# Altium schematic sheet ethernet_hdmi.SchDoc: Ethernet & HDMI
size A4; Organization: GPA Robotics; DocumentNumber: 9; Revision: REV 0; SheetNumber: 9; SheetTotal: 11
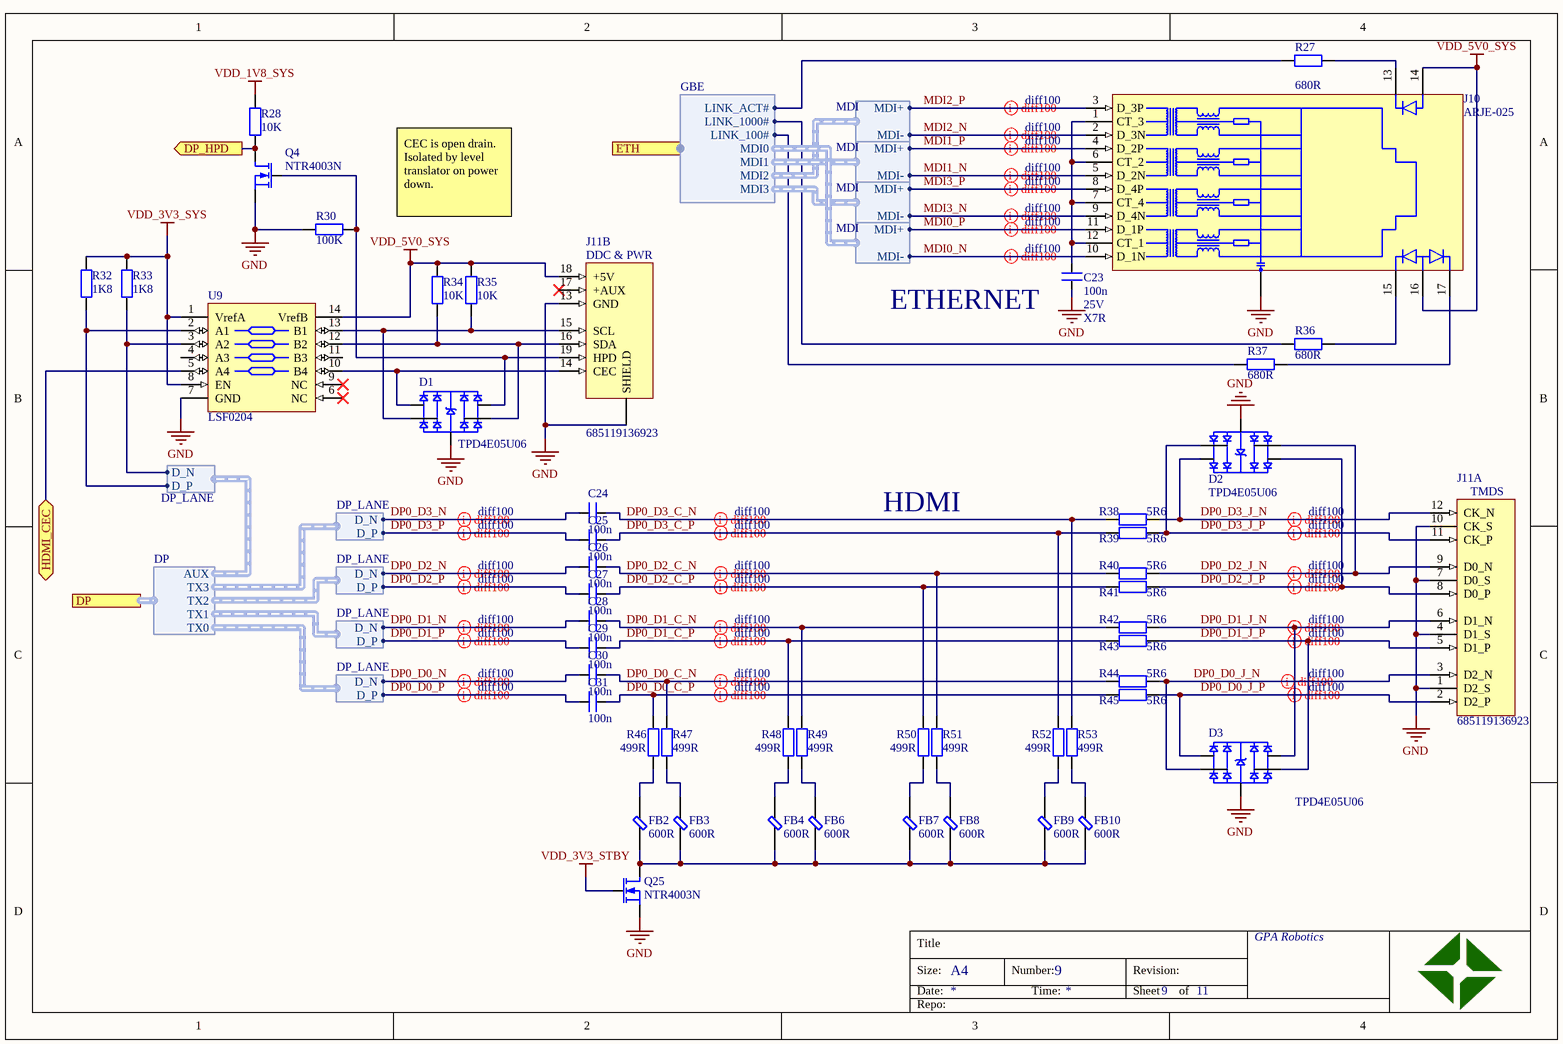
[diagram p0: ethernet_hdmi.SchDoc]

## Parts
C23  value 100n  Voltage: 25V  Type: X7R  [C1005[0402]]  (hidden comment: cap)
C24  value 100n  [C1005[0402]]  (hidden comment: cap)
C25  value 100n  [C1005[0402]]  (hidden comment: cap)
C26  value 100n  [C1005[0402]]  (hidden comment: cap)
C27  value 100n  [C1005[0402]]  (hidden comment: cap)
C28  value 100n  [C1005[0402]]  (hidden comment: cap)
C29  value 100n  [C1005[0402]]  (hidden comment: cap)
C30  value 100n  [C1005[0402]]  (hidden comment: cap)
C31  value 100n  [C1005[0402]]  (hidden comment: cap)
D1  TPD4E05U06  [TI_PSON50P100X55-10N]
D2  TPD4E05U06  [TI_PSON50P100X55-10N]
D3  TPD4E05U06  [TI_PSON50P100X55-10N]
FB2  value 600R  [FBC1005X06N]  (hidden comment: Ferrite bead)
FB3  value 600R  [FBC1005X06N]  (hidden comment: Ferrite bead)
FB4  value 600R  [FBC1005X06N]  (hidden comment: Ferrite bead)
FB6  value 600R  [FBC1005X06N]  (hidden comment: Ferrite bead)
FB7  value 600R  [FBC1005X06N]  (hidden comment: Ferrite bead)
FB8  value 600R  [FBC1005X06N]  (hidden comment: Ferrite bead)
FB9  value 600R  [FBC1005X06N]  (hidden comment: Ferrite bead)
FB10  value 600R  [FBC1005X06N]  (hidden comment: Ferrite bead)
J10  ARJE-025  [abraconn_rj45_arje0025]
J11  685119136923  [wurth_hdmi_mini]  (parts A,B of 2)
Q4  NTR4003N  [NCH_SOT95P237X110-3N]
Q25  NTR4003N  [NCH_SOT95P237X110-3N]
R27  value 680R  [R1005[0402]]  (hidden comment: res)
R28  value 10K  [R1005[0402]]  (hidden comment: res)
R30  value 100K  [R1005[0402]]  (hidden comment: res)
R32  value 1K8  [R1005[0402]]  (hidden comment: res)
R33  value 1K8  [R1005[0402]]  (hidden comment: res)
R34  value 10K  [R1005[0402]]  (hidden comment: res)
R35  value 10K  [R1005[0402]]  (hidden comment: res)
R36  value 680R  [R1005[0402]]  (hidden comment: res)
R37  value 680R  [R1005[0402]]  (hidden comment: res)
R38  value 5R6  [R1005[0402]]  (hidden comment: res)
R39  value 5R6  [R1005[0402]]  (hidden comment: res)
R40  value 5R6  [R1005[0402]]  (hidden comment: res)
R41  value 5R6  [R1005[0402]]  (hidden comment: res)
R42  value 5R6  [R1005[0402]]  (hidden comment: res)
R43  value 5R6  [R1005[0402]]  (hidden comment: res)
R44  value 5R6  [R1005[0402]]  (hidden comment: res)
R45  value 5R6  [R1005[0402]]  (hidden comment: res)
R46  value 499R  [R1005[0402]]  (hidden comment: res)
R47  value 499R  [R1005[0402]]  (hidden comment: res)
R48  value 499R  [R1005[0402]]  (hidden comment: res)
R49  value 499R  [R1005[0402]]  (hidden comment: res)
R50  value 499R  [R1005[0402]]  (hidden comment: res)
R51  value 499R  [R1005[0402]]  (hidden comment: res)
R52  value 499R  [R1005[0402]]  (hidden comment: res)
R53  value 499R  [R1005[0402]]  (hidden comment: res)
U9  LSF0204  [TI_TSOP65P640X120-14N]

## Ports
DP (harness DP), DP_HPD (out), ETH (harness GBE), HDMI_CEC (bidir)

## Harnesses
GBE: LINK_ACT#, LINK_1000#, LINK_100#, MDI0, MDI1, MDI2, MDI3
MDI: MDI+, MDI-
DP_LANE: D_N, D_P
DP: TX0, TX1, TX2, TX3, AUX

## Nets
GND: C23.1 D1.3(GND) D2.3(GND) D3.3(GND) J10.SHIELD J11.1(D2_S) J11.4(D1_S) J11.7(D0_S) J11.10(CK_S) J11.13(GND) J11.SHIELD Q4.S Q25.S R30.2 U9.7(GND)
VDD_1V8_SYS: R28.2
VDD_3V3_STBY: Q25.G
VDD_3V3_SYS: R32.2 R33.2 U9.1(VrefA) U9.8(EN)
VDD_5V0_SYS: J10.14 J10.16 J11.18(+5V) R34.2 R35.2 U9.14(VrefB)
DP0_D0_C_N: C30.1 R44.1 R47.2
DP0_D0_C_P: C31.1 R45.1 R46.2
DP0_D0_J_N: D3.4(D2-) J11.3(D2_N) R44.2
DP0_D0_J_P: D3.5(D2+) J11.2(D2_P) R45.2
DP0_D0_N: C30.2 ; harness DP_LANE.D_N
DP0_D0_P: C31.2 ; harness DP_LANE.D_P
DP0_D1_C_N: C28.1 R42.1 R49.2
DP0_D1_C_P: C29.1 R43.1 R48.2
DP0_D1_J_N: D3.1(D1+) J11.6(D1_N) R42.2
DP0_D1_J_P: D3.2(D1-) J11.5(D1_P) R43.2
DP0_D1_N: C28.2 ; harness DP_LANE.D_N
DP0_D1_P: C29.2 ; harness DP_LANE.D_P
DP0_D2_C_N: C26.1 R40.1 R51.2
DP0_D2_C_P: C27.1 R41.1 R50.2
DP0_D2_J_N: D2.2(D1-) J11.9(D0_N) R40.2
DP0_D2_J_P: D2.1(D1+) J11.8(D0_P) R41.2
DP0_D2_N: C26.2 ; harness DP_LANE.D_N
DP0_D2_P: C27.2 ; harness DP_LANE.D_P
DP0_D3_C_N: C24.1 R38.1 R53.2
DP0_D3_C_P: C25.1 R39.1 R52.2
DP0_D3_J_N: D2.5(D2+) J11.12(CK_N) R38.2
DP0_D3_J_P: D2.4(D2-) J11.11(CK_P) R39.2
DP0_D3_N: C24.2 ; harness DP_LANE.D_N
DP0_D3_P: C25.2 ; harness DP_LANE.D_P
DP_HPD: Q4.D R28.1 ; port DP_HPD
HDMI_CEC: U9.5(A4) ; port HDMI_CEC
MDI0_N: J10.10(D_1N) ; harness MDI.MDI-
MDI0_P: J10.11(D_1P) ; harness MDI.MDI+
MDI1_N: J10.5(D_2N) ; harness MDI.MDI-
MDI1_P: J10.4(D_2P) ; harness MDI.MDI+
MDI2_N: J10.2(D_3N) ; harness MDI.MDI-
MDI2_P: J10.3(D_3P) ; harness MDI.MDI+
MDI3_N: J10.9(D_4N) ; harness MDI.MDI-
MDI3_P: J10.8(D_4P) ; harness MDI.MDI+
NetC23_2: C23.2 J10.1(CT_3) J10.6(CT_2) J10.7(CT_4) J10.12(CT_1)
NetD1_1: D1.1(D1+) J11.14(CEC) U9.10(B4)
NetD1_2: D1.2(D1-) J11.15(SCL) R35.1 U9.13(B1)
NetD1_4: D1.4(D2-) J11.16(SDA) R34.1 U9.12(B2)
NetD1_5: D1.5(D2+) J11.19(HPD) Q4.G R30.1
NetFB2_1: FB2.1 FB3.1 FB4.1 FB6.1 FB7.1 FB8.1 FB9.1 FB10.1 Q25.D
NetFB2_2: FB2.2 R46.1
NetFB3_2: FB3.2 R47.1
NetFB4_2: FB4.2 R48.1
NetFB6_2: FB6.2 R49.1
NetFB7_2: FB7.2 R50.1
NetFB8_2: FB8.2 R51.1
NetFB9_2: FB9.2 R52.1
NetFB10_2: FB10.2 R53.1
NetJ10_13: J10.13 R27.1
NetJ10_15: J10.15 R36.2
NetJ10_17: J10.17 R37.1
NetR27_2: R27.2 ; port ETH.LINK_ACT#
NetR32_1: R32.1 U9.2(A1) ; harness DP_LANE.D_P
NetR33_1: R33.1 U9.3(A2) ; harness DP_LANE.D_N
NetR36_1: R36.1 ; port ETH.LINK_1000#
NetR37_2: R37.2 ; port ETH.LINK_100#

Not connected (* = marked no-connect by the designer): J11 17(+AUX)*; U9 4(A3) 6(NC)* 9(NC)* 11(B3)

## Layout directives
differential pair; net class diff100: DP0_D0_C_N, DP0_D0_C_P, DP0_D0_J_N, DP0_D0_J_P, DP0_D0_N, DP0_D0_P, DP0_D1_C_N, DP0_D1_C_P, DP0_D1_J_N, DP0_D1_J_P, DP0_D1_N, DP0_D1_P, DP0_D2_C_N, DP0_D2_C_P, DP0_D2_J_N, DP0_D2_J_P, DP0_D2_N, DP0_D2_P, DP0_D3_C_N, DP0_D3_C_P, DP0_D3_J_N, DP0_D3_J_P, DP0_D3_N, DP0_D3_P, MDI0_N, MDI0_P, MDI1_N, MDI1_P, MDI2_N, MDI2_P, MDI3_N, MDI3_P

## Notes on the sheet
- CEC is open drain.
  Isolated by level translator on power down.
- ETHERNET
- HDMI
- Title
- Size:
- Date:
- A4
- Number:
- Time:
- Revision:
- Sheet
- of
- Repo:
- (in symbol hdmi_mini_c, part A) TMDS
- (in symbol hdmi_mini_c, part B) DDC & PWR

## Library data of the parts
C23 = cap: Capacitor; Manufacturer: *; Series: *
C24-C31 = cap: Capacitor; Voltage: 25V; Type: X7R; Manufacturer: *; Series: *
FB2-FB4 FB6-FB10 = ferrite_bead: Frequency: 100M
J10 = geth_wmagnetics: RJ45 with integrated magnetics
J11 = hdmi_mini_c
Q4 Q25 = nch_mosfet
R27 R28 R30 R32-R53 = res: Resistor